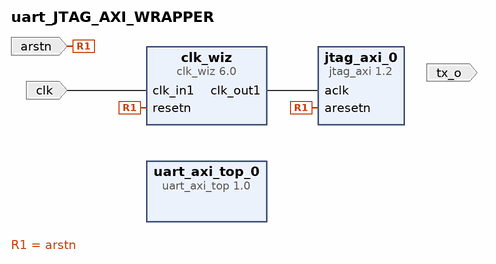
[diagram p0: block diagram of the top level]
# Vivado block design uart_JTAG_AXI_WRAPPER, xc7a100tcsg324-1, Vivado 2024.2
create_bd_design uart_JTAG_AXI_WRAPPER

create_bd_port -dir I -type clk clk
set_property -dict {CONFIG.FREQ_HZ 100000000} [get_bd_ports clk]
create_bd_port -dir I -type rst arstn
create_bd_port -dir O -type data tx_o

create_bd_cell -type ip -vlnv xilinx.com:ip:jtag_axi:1.2 jtag_axi_0
set_property -dict {CONFIG.M_AXI_ID_WIDTH 1} [get_bd_cells jtag_axi_0]
create_bd_cell -type ip -vlnv xilinx.com:ip:clk_wiz:6.0 clk_wiz
set_property -dict [list \
  CONFIG.CLKOUT1_REQUESTED_OUT_FREQ 100.0 \
  CONFIG.RESET_PORT resetn \
  CONFIG.RESET_TYPE ACTIVE_LOW \
] [get_bd_cells clk_wiz]
create_bd_cell -type ip -vlnv xilinx.com:user:uart_axi_top:1.0 uart_axi_top_0

# ---- connections ----

connect_bd_net [get_bd_ports arstn] [get_bd_pins jtag_axi_0/aresetn] [get_bd_pins clk_wiz/resetn]
connect_bd_net [get_bd_ports clk] [get_bd_pins clk_wiz/clk_in1]
connect_bd_net [get_bd_pins clk_wiz/clk_out1] [get_bd_pins jtag_axi_0/aclk]

validate_bd_design
save_bd_design
